# Altium project Integrated board-STM32.PrjPcb
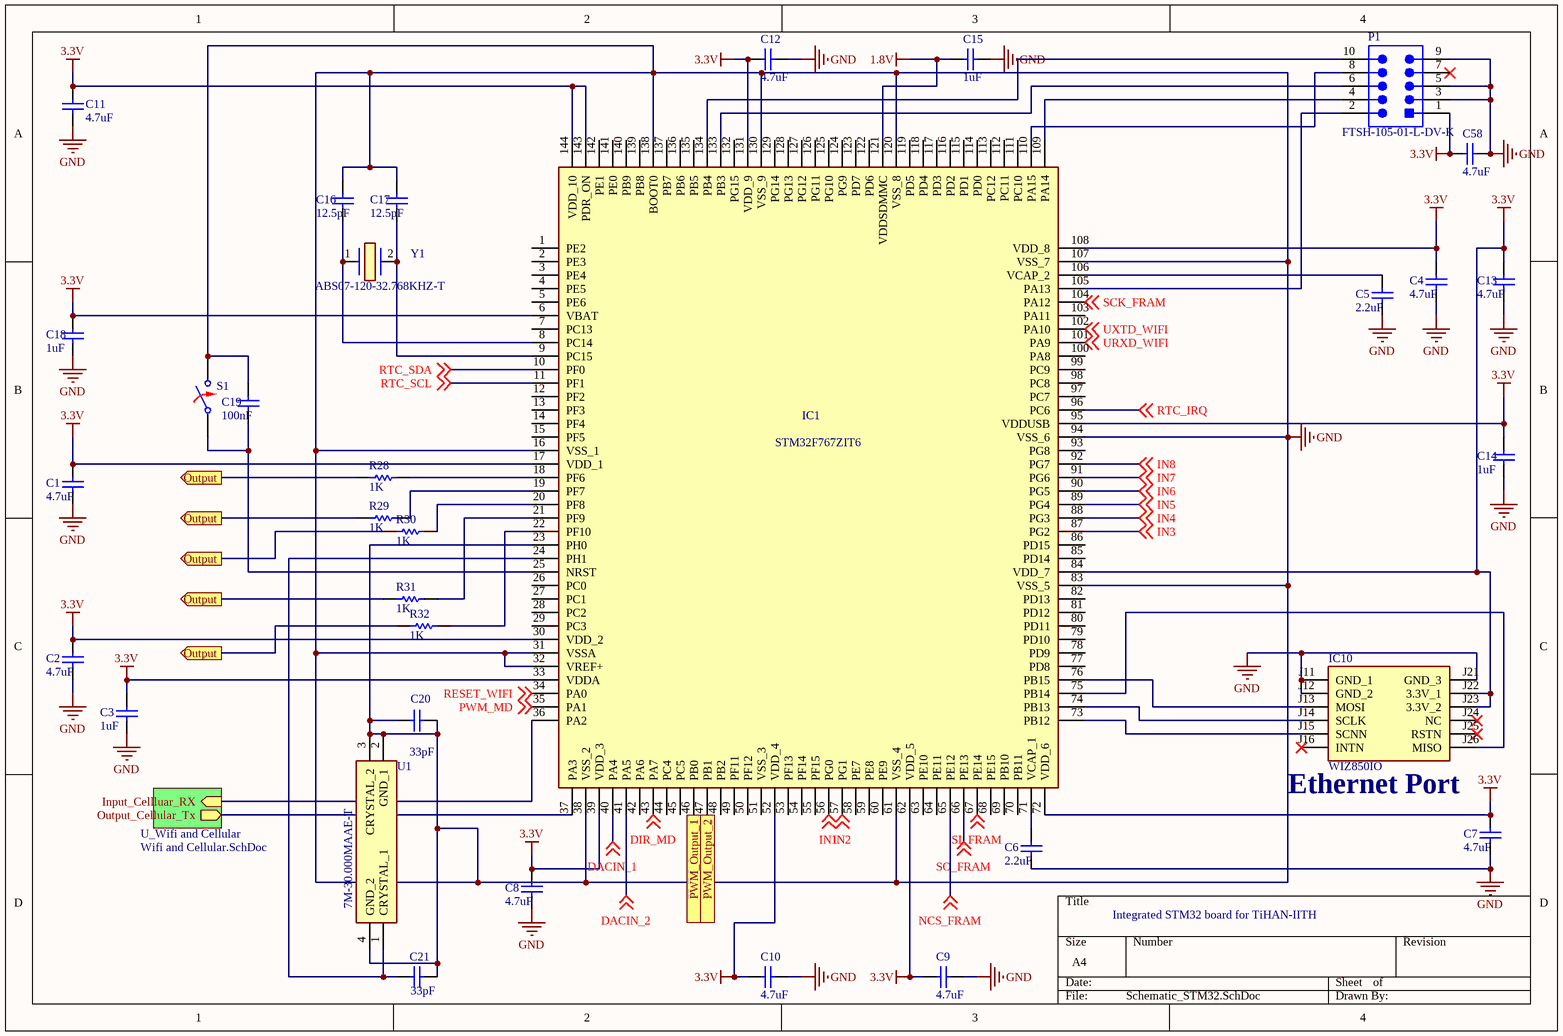
[diagram p0: Schematic_STM32.SchDoc]
7 sheets, 204 parts. Net scope: hierarchical (ports join the sheet entries above them; power ports are global).
Sheets:
  Schematic_STM32.SchDoc
  supply.SchDoc
  Relay_circuit.SchDoc
  Relay circuit_12V.SchDoc
  Wifi, Cellular, MD and FRAM.SchDoc
  Signal conditioning.SchDoc
  PWM_Generator.SchDoc

## Sheet Schematic_STM32.SchDoc
size A4; SheetNumber: 1; SheetTotal: 8

### Parts
(Parts that share a designator on the sheet are numbered #1, #2 ... from top to bottom, then left to right.)
C1  value 4.7uF  [C1206]  (hidden comment: Cap)
C2  value 4.7uF  [C1206]  (hidden comment: Cap)
C3  value 1uF  [C1206]  (hidden comment: Cap)
C4  value 4.7uF  [C1206]  (hidden comment: Cap)
C5  value 2.2uF  [C1206]  (hidden comment: Cap)
C6  value 2.2uF  [C1206]  (hidden comment: Cap)
C7  value 4.7uF  [C1206]  (hidden comment: Cap)
C8  value 4.7uF  [C1206]  (hidden comment: Cap)
C9  value 4.7uF  [C1206]  (hidden comment: Cap)
C10  value 4.7uF  [C1206]  (hidden comment: Cap)
C11  value 4.7uF  [C1206]  (hidden comment: Cap)
C12  value 4.7uF  [C1206]  (hidden comment: Cap)
C13  value 4.7uF  [C1206]  (hidden comment: Cap)
C14  value 1uF  [C1206]  (hidden comment: Cap)
C15  value 1uF  [C1206]  (hidden comment: Cap)
C16  value 12.5pF  [C1206]  (hidden comment: Cap)
C17  value 12.5pF  [C1206]  (hidden comment: Cap)
C18  value 1uF  [C1206]  (hidden comment: Cap)
C19  value 100nF  [C1206]  (hidden comment: Cap)
C20  value 33pF  [RAD-0.3]  (hidden comment: Cap)
C21  value 33pF  [RAD-0.3]  (hidden comment: Cap)
C58  value 4.7uF  [C1206]  (hidden comment: Cap)
IC1  STM32F767ZIT6  [QFP50P2200X2200X160-144N]
IC10  WIZ850IO  [WIZ850IO]
P1#1  FTSH-105-01-L-DV-K  [SMTC-FTSH-105-01-L-DV-K_V]
R28  value 1K  (hidden comment: Resistor)
R29  value 1K  (hidden comment: Resistor)
R30  value 1K  (hidden comment: Resistor)
R31  value 1K  (hidden comment: Resistor)
R32  value 1K  (hidden comment: Resistor)
S1  Switch Normally Opened  (value not drawn)
U1  7M-30.000MAAE-T  [7M]
Y1  ABS07-120-32.768KHZ-T  [ABS07]

### Sub-sheets
U_Wifi and Cellular = Wifi and Cellular.SchDoc (file not in this document): Input_Cellluar_RX (in), Output_Cellular_Tx (out)

### Ports
Output (out), PWM_Output_1 (out), PWM_Output_2 (out)

### Nets
1.8V: C15.1 IC1.121(VDDSDMMC)
3.3V: C1.1 C2.1 C3.1 C4.1 C7.1 C8.1 C9.1 C10.1 C11.1 C12.1 C13.1 C14.1 C18.1 C58.1 IC1.6(VBAT) IC1.17(VDD_1) IC1.30(VDD_2) IC1.33(VDDA) IC1.34(PA0) IC1.39(VDD_3) IC1.52(VDD_4) IC1.62(VDD_5) IC1.72(VDD_6) IC1.84(VDD_7) IC1.95(VDDUSB) IC1.108(VDD_8) IC1.131(VDD_9) IC1.143(PDR_ON) IC1.144(VDD_10) IC10.J22(3.3V_1) IC10.J23(3.3V_2) P1#1.1 ; off-sheet RESET_WIFI  [also labelled RESET_WIFI]
GND: C1.2 C2.2 C3.2 C4.2 C5.2 C6.2 C7.2 C8.2 C9.2 C10.2 C11.2 C12.2 C13.2 C14.2 C15.2 C16.1 C17.1 C18.2 C19.1 C20.1 C20.2 C21.2 C58.2 IC1.16(VSS_1) IC1.23(PH0) IC1.31(VSSA) IC1.32(VREF+) IC1.38(VSS_2) IC1.61(VSS_4) IC1.83(VSS_5) IC1.94(VSS_6) IC1.107(VSS_7) IC1.120(VSS_8) IC1.130(VSS_9) IC1.138(BOOT0) IC10.J11(GND_1) IC10.J12(GND_2) IC10.J21(GND_3) P1#1.3 P1#1.5 P1#1.9 S1.2 U1.2(GND_1) U1.3(CRYSTAL_2) U1.4(GND_2)
DACIN_1: IC1.40(PA4) ; off-sheet DACIN_1
DACIN_2: IC1.41(PA5) ; off-sheet DACIN_2
DIR_MD: IC1.43(PA7) ; off-sheet DIR_MD
IN1: IC1.56(PG0) ; off-sheet IN1
IN2: IC1.57(PG1) ; off-sheet IN2
IN3: IC1.87(PG2) ; off-sheet IN3
IN4: IC1.88(PG3) ; off-sheet IN4
IN5: IC1.89(PG4) ; off-sheet IN5
IN6: IC1.90(PG5) ; off-sheet IN6
IN7: IC1.91(PG6) ; off-sheet IN7
IN8: IC1.92(PG7) ; off-sheet IN8
NCS_FRAM: IC1.65(PE12) ; off-sheet NCS_FRAM
PWM_MD: IC1.35(PA1) ; off-sheet PWM_MD
RTC_IRQ: IC1.96(PC6) ; off-sheet RTC_IRQ
RTC_SCL: IC1.11(PF1) ; off-sheet RTC_SCL
RTC_SDA: IC1.10(PF0) ; off-sheet RTC_SDA
SCK_FRAM: IC1.104(PA12) ; off-sheet SCK_FRAM
SI_FRAM: IC1.67(PE14) ; off-sheet SI_FRAM
SO_FRAM: IC1.66(PE13) ; off-sheet SO_FRAM
URXD_WIFI: IC1.101(PA9) ; off-sheet URXD_WIFI
UXTD_WIFI: IC1.102(PA10) ; off-sheet UXTD_WIFI
NetC5_1: C5.1 IC1.106(VCAP_2)
NetC6_1: C6.1 IC1.71(VCAP_1)
NetC16_2: C16.2 IC1.8(PC14) Y1.1
NetC17_2: C17.2 IC1.9(PC15) Y1.2
NetC19_2: C19.2 IC1.25(NRST) S1.1
NetC21_1: C21.1 IC1.24(PH1) U1.1(CRYSTAL_1)
NetIC1_18: IC1.18(PF6) R28.2
NetIC1_19: IC1.19(PF7) R29.2
NetIC1_20: IC1.20(PF8) R30.2
NetIC1_21: IC1.21(PF9) R31.2
NetIC1_22: IC1.22(PF10) R32.2
NetIC1_36: IC1.36(PA2) ; sheet U_Wifi and Cellular/Input_Cellluar_RX
NetIC1_37: IC1.37(PA3) ; sheet U_Wifi and Cellular/Output_Cellular_Tx
NetIC1_46: IC1.46(PB0) ; port PWM_Output_1
NetIC1_47: IC1.47(PB1) ; port PWM_Output_2
NetIC1_73: IC1.73(PB12) IC10.J15(SCNN)
NetIC1_74: IC1.74(PB13) IC10.J14(SCLK)
NetIC1_75: IC1.75(PB14) IC10.J26(MISO)
NetIC1_76: IC1.76(PB15) IC10.J13(MOSI)
NetIC1_105: IC1.105(PA13) P1#1.2
NetIC1_109: IC1.109(PA14) P1#1.4
NetIC1_110: IC1.110(PA15) P1#1.8
NetIC1_133: IC1.133(PB3) P1#1.6
NetIC1_134: IC1.134(PB4) P1#1.10
NetR28_1: R28.1 R29.1 R30.1 R31.1 R32.1 ; port Output

Not connected (* = marked no-connect by the designer): IC1 1(PE2) 2(PE3) 3(PE4) 4(PE5) 5(PE6) 7(PC13) 12(PF2) 13(PF3) 14(PF4) 15(PF5) 26(PC0) 27(PC1) 28(PC2) 29(PC3) 42(PA6) 44(PC4) 45(PC5) 48(PB2) 49(PF11) 50(PF12) 51(VSS_3) 53(PF13) 54(PF14) 55(PF15) 58(PE7) 59(PE8) 60(PE9) 63(PE10) 64(PE11) 68(PE15) 69(PB10) 70(PB11) 77(PD8) 78(PD9) 79(PD10) 80(PD11) 81(PD12) 82(PD13) 85(PD14) 86(PD15) 93(PG8) 97(PC7) 98(PC8) 99(PC9) 100(PA8) 103(PA11) 111(PC10) 112(PC11) 113(PC12) 114(PD0) 115(PD1) 116(PD2) 117(PD3) 118(PD4) 119(PD5) 122(PD6) 123(PD7) 124(PG9) 125(PG10) 126(PG11) 127(PG12) 128(PG13) 129(PG14) 132(PG15) 135(PB5) 136(PB6) 137(PB7) 139(PB8) 140(PB9) 141(PE0) 142(PE1); IC10 J16(INTN)* J24(NC)* J25(RSTN)*; P1#1 7*

### Notes on the sheet
- Ethernet Port
- Integrated STM32 board for TiHAN-IITH

### Library data of the parts
C1-C19 C58 = Cap Semi: Capacitor (Semiconductor SIM Model); Published: 8-Jun-2000; LatestRevisionDate: 29-May-2009; LatestRevisionNote: IPC-7351 Footprint Added.; PackageReference: C1206; Publisher: Altium Limited; PackageDescription: Chip Capacitor
C20 C21 = Cap: Capacitor; Published: 8-Jun-2000; LatestRevisionDate: 17-Jul-2002; LatestRevisionNote: Re-released for DXP Platform.; PackageReference: RAD-0.3; Publisher: Altium Limited; PackageDescription: Radial Cap, Thru-Hole; 2 Leads; 0.3 in Pin Spacing
IC1 = STM32F767ZIT6: Integrated Circuit; Manufacturer_Name: STMicroelectronics; Datasheet Link: http://www.farnell.com/datasheets/2034586.pdf; Height: 1.6mm; Manufacturer_Part_Number: STM32F767ZIT6; Mouser Part Number: 511-STM32F767ZIT6; Mouser Price/Stock: https://www.mouser.co.uk/ProductDetail/STMicroelectronics/STM32F767ZIT6?qs=dTJS0cRn7ojkBH6ijW6kKw%3D%3D; Arrow Part Number: STM32F767ZIT6; Arrow Price/Stock: https://www.arrow.com/en/products/stm32f767zit6/stmicroelectronics?region=nac
IC10 = WIZ850IO: Integrated Circuit; Manufacturer_Name: Wiznet Technology; Datasheet Link: https://docs.wiznet.io/Product/ioModule/wiz850io; Height: 18mm; Manufacturer_Part_Number: WIZ850IO; Mouser Part Number: 950-WIZ850IO; Arrow Part Number: WIZ850IO; Arrow Price/Stock: https://www.arrow.com/en/products/wiz850io/wiznet?region=nac
P1#1 = CMP-2000-05353-1: Male Header, Pitch 1.27 mm, 2 x 5 Position, Height 6.25 mm; Manufacturer: Samtec; Pitch: 0.050"(1.27mm); Other Names: Q3937619; Number of Positions: 10; Mating Products: SFMC-105-L2-S-D-TR-ND / -CONN.05"SURFACE10POSSMT / FLE-105-01-G-DV-TR-ND / -CONNSKT1.27MM10POSDUALSMD / FLE-105-01-G-DV-A-P-ND / -CONNSKT1.27MM10POSDUALSMD / FLE-105-01-G-DV-A-ND / -CONNSKT1.27MM10POSDUALSMD / CLP-105-02-G-D-P-TR-ND / -CONNRCPT10POSDUAL.05"SMD / SAM1155-05-ND / -CONNRCPT10POSDUAL.05"SMD / SAM1154-05-ND / -CONNRCPT10POSDUAL.05"SMD / SAM1153-05-ND / -CONNRCPT10POSDUAL.05"SMD / SAM1226-05-ND / -CONNRCPT.05"10POSDUALSMD; Number of Positions Loaded: All; Connector Type: Header,Unshrouded; Product Training Modules: Board-to-BoardConnectors; Datasheet Version: Rev. ET, 10/1995; Number of Rows: 2; Standard Package: 1; Package Description: Male Header, Pitch 1.27 mm, 2 x 5 Position, Height 5.97 mm, Tail Length 4.32 mm; Contact Finish Thickness: 10µin(0.25µm); Series: FTSH; Termination: Solder; Contact Type: MalePin; Color: Black; Package Reference: FTSH-105-01-L-DV-K; Family: RectangularConnectors-Headers,MalePins; Package URL: http://suddendocs.samtec.com/prints/ftsh-1xx-xx-xxx-dv-xxx-footprint.pdf; Packaging: Tube; Mounting Type: SurfaceMount; Category: Connectors,Interconnects; Datasheet URL: http://suddendocs.samtec.com/prints/ftsh-1xx-xx-xxx-dv-xxx-mkt.pdf; Row Spacing: 0.050"(1.27mm); Manufacturer URL: http://www.samtec.com/; Contact Mating Length: 0.120"(3.05mm); Contact Finish: Gold
R28-R32 = Resistor: TC1: 0; SimulationGenericComponent: True; TC2: 0
S1 = SW NO: closed: 0; Rclosed: 1m; Ropen: 1Meg; SimulationGenericComponent: True
U1 = 7M-30.000MAAE-T: Crystal or Oscillator; Manufacturer_Name: TXC; Datasheet Link: http://www.txccorp.com/download/products/quartz_crystals/2015TXC_7M_17.pdf; Manufacturer_Part_Number: 7M-30.000MAAE-T; Mouser Part Number: 717-7M-30.000MAAE-T; Mouser Price/Stock: https://www.mouser.com/Search/Refine.aspx?Keyword=717-7M-30.000MAAE-T
Y1 = ABS07-120-32.768KHZ-T: Crystal or Oscillator; Manufacturer_Name: ABRACON; Datasheet Link: https://abracon.com/Resonators/ABS07.pdf; Height: 0.9mm; Manufacturer_Part_Number: ABS07-120-32.768KHZ-T; Mouser Part Number: 815-ABS0712032.768KT; Mouser Price/Stock: https://www.mouser.co.uk/ProductDetail/ABRACON/ABS07-120-32.768KHZ-T?qs=z9S2%252BbP5pWhyNaQ4AovDCg%3D%3D; Arrow Part Number: ABS07-120-32.768KHZ-T; Arrow Price/Stock: https://www.arrow.com/en/products/abs07-120-32.768khz-t/abracon?region=nac

## Sheet supply.SchDoc
size A4; SheetNumber: 2; SheetTotal: 9
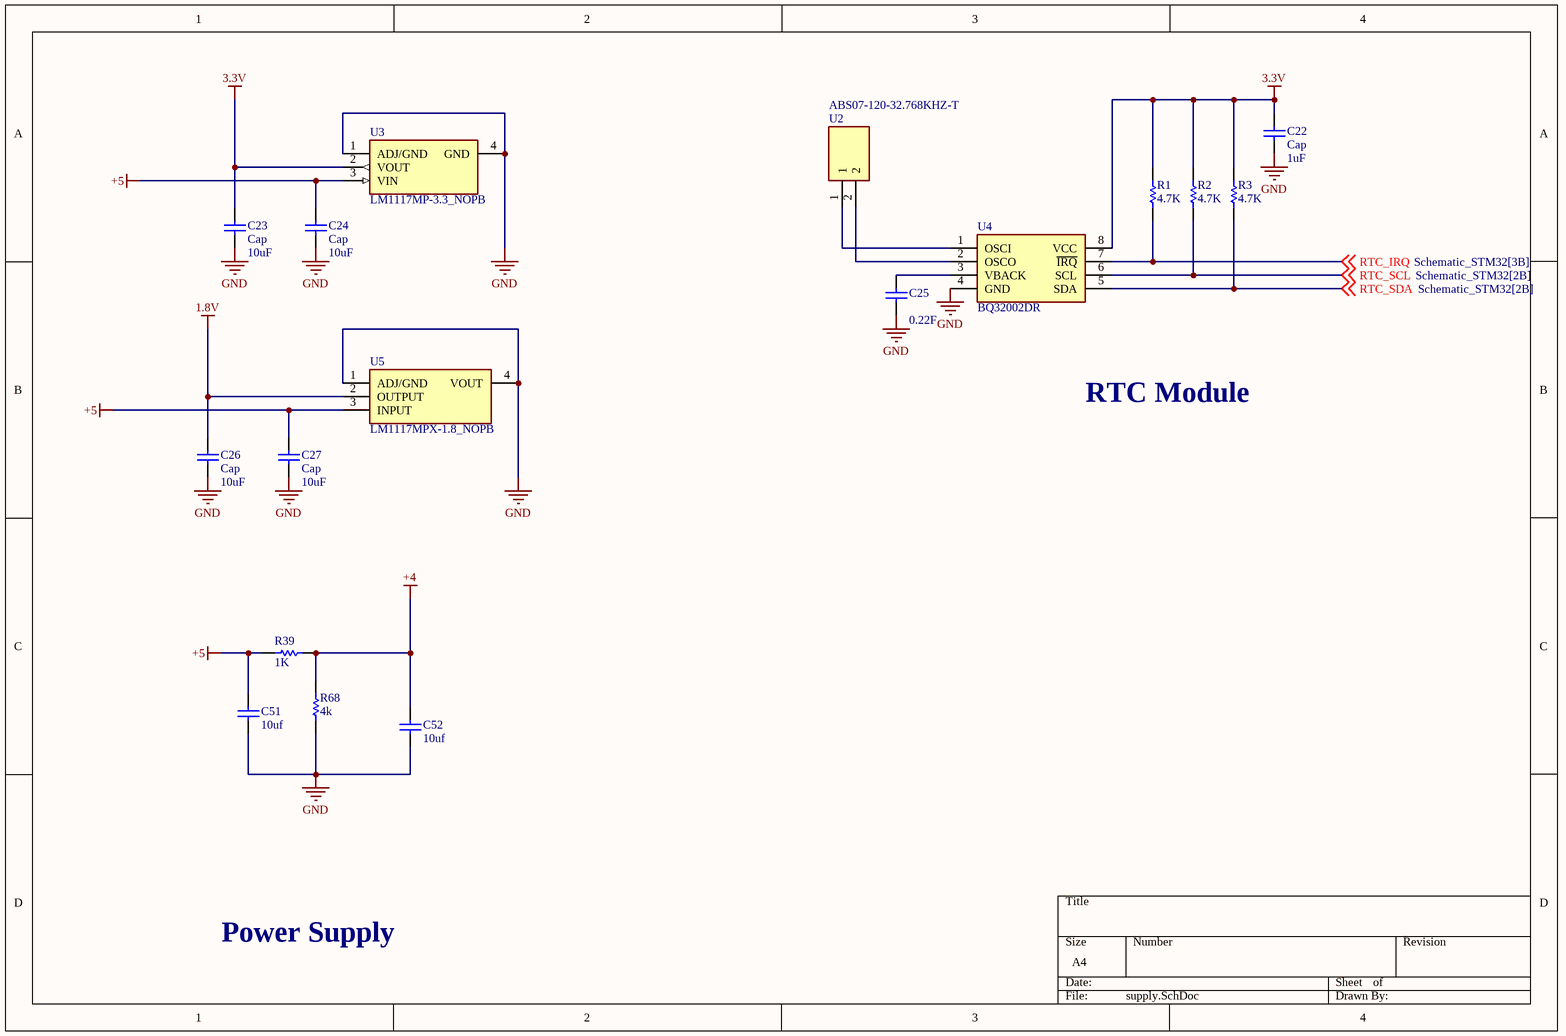
[diagram p1: supply.SchDoc]

### Parts
C22  Cap  value 1uF  [RAD-0.3]
C23  Cap  value 10uF  [RAD-0.3]
C24  Cap  value 10uF  [RAD-0.3]
C25  value 0.22F  [RAD-0.3]  (hidden comment: Cap)
C26  Cap  value 10uF  [RAD-0.3]
C27  Cap  value 10uF  [RAD-0.3]
C51  value 10uf  (hidden comment: Capacitor)
C52  value 10uf  (hidden comment: Capacitor)
R1  value 4.7K  [AXIAL-0.3]  (hidden comment: Res1)
R2  value 4.7K  [AXIAL-0.3]  (hidden comment: Res1)
R3  value 4.7K  [AXIAL-0.3]  (hidden comment: Res1)
R39  value 1K  (hidden comment: Resistor)
R68  value 4k  (hidden comment: Resistor)
U2  ABS07-120-32.768KHZ-T  [ABS-07]
U3  LM1117MP-3.3_NOPB  [SOT230P700X180-4N]
U4  BQ32002DR  [SOIC127P600X175-8N]
U5  LM1117MPX-1.8_NOPB  [SOT230P700X180-4N]

### Nets
1.8V: C26.2 U5.2(OUTPUT)
3.3V: C22.2 C23.2 R1.1 R2.1 R3.1 U3.2(VOUT) U4.8(VCC)
+4: C52.2 R39.2 R68.2
+5: C24.2 C27.2 C51.2 R39.1 U3.3(VIN) U5.3(INPUT)
GND: C22.1 C23.1 C24.1 C25.1 C26.1 C27.1 C51.1 C52.1 R68.1 U3.1(ADJ/GND) U3.4(GND) U4.4(GND) U5.1(ADJ/GND) U5.4(VOUT)
RTC_IRQ: R1.2 U4.7(~{IRQ}) ; off-sheet RTC_IRQ
RTC_SCL: R2.2 U4.6(SCL) ; off-sheet RTC_SCL
RTC_SDA: R3.2 U4.5(SDA) ; off-sheet RTC_SDA
NetC25_2: C25.2 U4.3(VBACK)
NetU2_1: U2.1 U4.1(OSCI)
NetU2_2: U2.2 U4.2(OSCO)

### Notes on the sheet
- RTC Module
- Power Supply

### Library data of the parts
C22-C27 = Cap: Capacitor; Published: 8-Jun-2000; LatestRevisionDate: 17-Jul-2002; LatestRevisionNote: Re-released for DXP Platform.; PackageReference: RAD-0.3; Publisher: Altium Limited; PackageDescription: Radial Cap, Thru-Hole; 2 Leads; 0.3 in Pin Spacing
C51 C52 = Capacitor: SimulationGenericComponent: True
R1-R3 = Res1: Resistor; Published: 8-Jun-2000; LatestRevisionDate: 17-Jul-2002; LatestRevisionNote: Re-released for DXP Platform.; PackageReference: AXIAL-0.3; Publisher: Altium Limited; PackageDescription: Axial Device, Thru-Hole; 2 Leads; 0.3 in Pin Spacing
R39 R68 = Resistor: TC1: 0; SimulationGenericComponent: True; TC2: 0
U2 = ABS07-120-32.768KHZ-T: as Y1 on sheet Schematic_STM32; Datasheet Link: http://www.abracon.com/Resonators/ABS07-120-32.768kHz-T.pdf; Manufacturer_Part_Number: ABS07-120-32.768KHZ-T; Mouser Part Number: 815-ABS0712032.768KT; Mouser Price/Stock: https://www.mouser.co.uk/ProductDetail/ABRACON/ABS07-120-32768KHZ-T?qs=z9S2%252BbP5pWhyNaQ4AovDCg%3D%3D; RS Part Number: 1712688P; RS Price/Stock: http://uk.rs-online.com/web/p/products/1712688P
U3 = LM1117MP-3.3_NOPB: Integrated Circuit; Manufacturer_Name: Texas Instruments; Manufacturer_Part_Number: LM1117MP-3.3/NOPB; Datasheet Link: http://docs-emea.rs-online.com/webdocs/0780/0900766b807800d2.pdf; Height: 1.8mm; Mouser Part Number: 926-LM1117MP-3.3NOPB; Mouser Price/Stock: https://www.mouser.com/Search/Refine.aspx?Keyword=926-LM1117MP-3.3NOPB; RS Part Number: 5339577P; RS Price/Stock: http://uk.rs-online.com/web/p/products/5339577P
U4 = BQ32002DR: Integrated Circuit; Manufacturer_Name: Texas Instruments; Datasheet Link: http://www.ti.com/lit/gpn/bq32002; Height: 1.75mm; Manufacturer_Part_Number: BQ32002DR; Mouser Part Number: 595-BQ32002DR; Mouser Price/Stock: https://www.mouser.com/Search/Refine.aspx?Keyword=595-BQ32002DR
U5 = LM1117MPX-1.8_NOPB: Integrated Circuit; Manufacturer_Name: Texas Instruments; Manufacturer_Part_Number: LM1117MPX-1.8/NOPB; Datasheet Link: http://www.ti.com/lit/gpn/lm1117; Height: 1.8mm; Mouser Part Number: 926-LM1117MPX1.8NOPB; Mouser Price/Stock: https://www.mouser.com/Search/Refine.aspx?Keyword=926-LM1117MPX1.8NOPB

## Sheet Relay_circuit.SchDoc
size A4; SheetNumber: 3; SheetTotal: 6
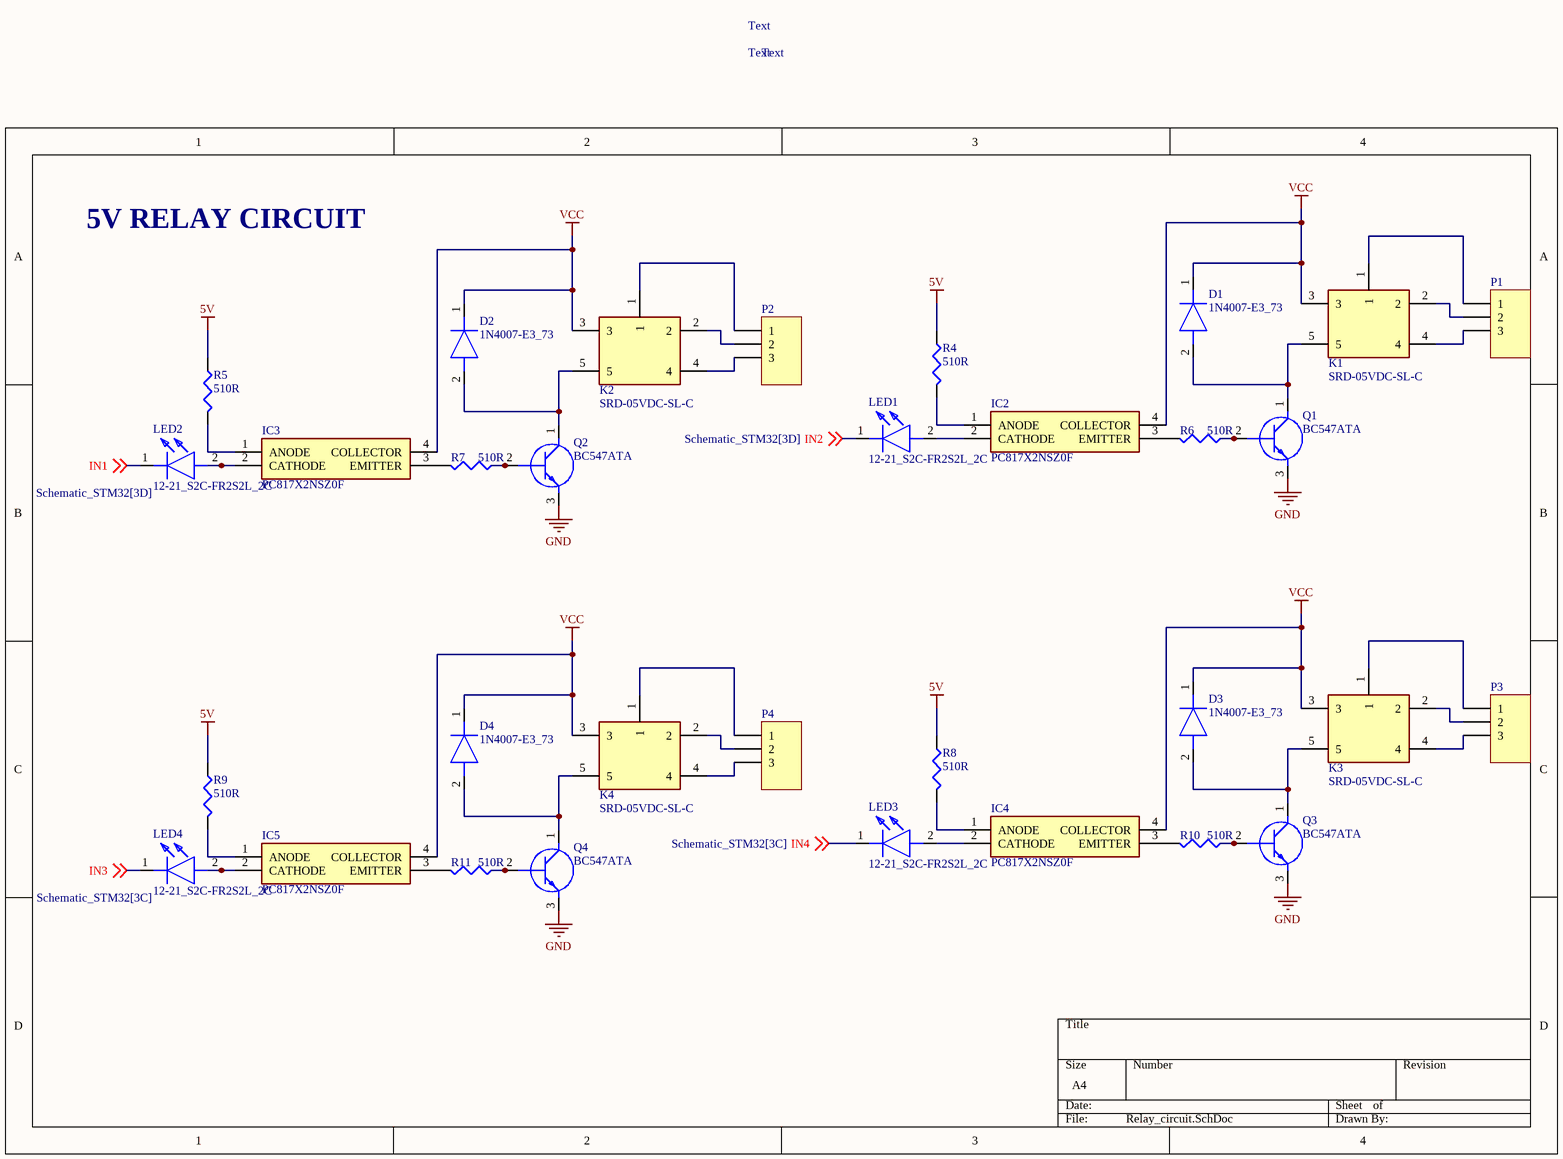
[diagram p2: Relay_circuit.SchDoc]

### Parts
(Parts that share a designator on the sheet are numbered #1, #2 ... from top to bottom, then left to right.)
D1  1N4007-E3_73  [DIOAD1405W86L465D235]
D2  1N4007-E3_73  [DIOAD1405W86L465D235]
D3  1N4007-E3_73  [DIOAD1405W86L465D235]
D4  1N4007-E3_73  [DIOAD1405W86L465D235]
IC2  PC817X2NSZ0F  [DIP762W60P254L458H400Q4N]
IC3  PC817X2NSZ0F  [DIP762W60P254L458H400Q4N]
IC4  PC817X2NSZ0F  [DIP762W60P254L458H400Q4N]
IC5  PC817X2NSZ0F  [DIP762W60P254L458H400Q4N]
K1  SRD-05VDC-SL-C  [SRD]
K2  SRD-05VDC-SL-C  [SRD]
K3  SRD-05VDC-SL-C  [SRD]
K4  SRD-05VDC-SL-C  [SRD]
LED1  12-21_S2C-FR2S2L_2C  [1221S2CFR2S2L2C]
LED2  12-21_S2C-FR2S2L_2C  [1221S2CFR2S2L2C]
LED3  12-21_S2C-FR2S2L_2C  [1221S2CFR2S2L2C]
LED4  12-21_S2C-FR2S2L_2C  [1221S2CFR2S2L2C]
P1#2  Header 3  [CON4PIN5MM]  (value not drawn)
P2  Header 3  [CON4PIN5MM]  (value not drawn)
P3  Header 3  [CON4PIN5MM]  (value not drawn)
P4  Header 3  [CON4PIN5MM]  (value not drawn)
Q1  BC547ATA  [TO-92_(TO-226)]
Q2  BC547ATA  [TO-92_(TO-226)]
Q3  BC547ATA  [TO-92_(TO-226)]
Q4  BC547ATA  [TO-92_(TO-226)]
R4  value 510R  [J1-0603]  (hidden comment: Res3)
R5  value 510R  [J1-0603]  (hidden comment: Res3)
R6  value 510R  [J1-0603]  (hidden comment: Res3)
R7  value 510R  [J1-0603]  (hidden comment: Res3)
R8  value 510R  [J1-0603]  (hidden comment: Res3)
R9  value 510R  [J1-0603]  (hidden comment: Res3)
R10  value 510R  [J1-0603]  (hidden comment: Res3)
R11  value 510R  [J1-0603]  (hidden comment: Res3)

### Nets
5V: R4.1 R5.1 R8.1 R9.1
GND: Q1.3(E) Q2.3(E) Q3.3(E) Q4.3(E)
VCC: D1.1(K) D2.1(K) D3.1(K) D4.1(K) IC2.4(COLLECTOR) IC3.4(COLLECTOR) IC4.4(COLLECTOR) IC5.4(COLLECTOR) K1.3 K2.3 K3.3 K4.3
IN1: LED2.1(K) ; off-sheet IN1
IN2: LED1.1(K) ; off-sheet IN2
IN3: LED4.1(K) ; off-sheet IN3
IN4: LED3.1(K) ; off-sheet IN4
NetD1_2: D1.2(A) K1.5 Q1.1(C)
NetD2_2: D2.2(A) K2.5 Q2.1(C)
NetD3_2: D3.2(A) K3.5 Q3.1(C)
NetD4_2: D4.2(A) K4.5 Q4.1(C)
NetIC2_1: IC2.1(ANODE) R4.2
NetIC2_2: IC2.2(CATHODE) LED1.2(A)
NetIC2_3: IC2.3(EMITTER) R6.2
NetIC3_1: IC3.1(ANODE) R5.2
NetIC3_2: IC3.2(CATHODE) LED2.2(A)
NetIC3_3: IC3.3(EMITTER) R7.2
NetIC4_1: IC4.1(ANODE) R8.2
NetIC4_2: IC4.2(CATHODE) LED3.2(A)
NetIC4_3: IC4.3(EMITTER) R10.2
NetIC5_1: IC5.1(ANODE) R9.2
NetIC5_2: IC5.2(CATHODE) LED4.2(A)
NetIC5_3: IC5.3(EMITTER) R11.2
NetK1_1: K1.1 P1#2.1
NetK1_2: K1.2 P1#2.2
NetK1_4: K1.4 P1#2.3
NetK2_1: K2.1 P2.1
NetK2_2: K2.2 P2.2
NetK2_4: K2.4 P2.3
NetK3_1: K3.1 P3.1
NetK3_2: K3.2 P3.2
NetK3_4: K3.4 P3.3
NetK4_1: K4.1 P4.1
NetK4_2: K4.2 P4.2
NetK4_4: K4.4 P4.3
NetQ1_2: Q1.2(B) R6.1
NetQ2_2: Q2.2(B) R7.1
NetQ3_2: Q3.2(B) R10.1
NetQ4_2: Q4.2(B) R11.1

Not connected (* = marked no-connect by the designer): P1#2 4; P2 4; P3 4; P4 4

### Notes on the sheet
- Text
- 5V RELAY CIRCUIT

### Library data of the parts
D1-D4 = 1N4007-E3_73: Diode; Manufacturer_Name: Vishay; Manufacturer_Part_Number: 1N4007-E3/73; Datasheet Link: https://mouser.componentsearchengine.com/Datasheets/2/1N4007-E3_73.pdf; Mouser Part Number: 625-1N4007-E3/73; Mouser Price/Stock: https://www.mouser.co.uk/ProductDetail/Vishay-General-Semiconductor/1N4007-E3-73?qs=N4vtoAxH%2FSqT3Ng3e4K0Gw%3D%3D; Arrow Part Number: 1N4007-E3/73; Arrow Price/Stock: https://www.arrow.com/en/products/1n4007-e373/vishay?region=europe
IC2-IC5 = PC817X2NSZ0F: Integrated Circuit; Manufacturer_Name: Sharp Microelectronics; Datasheet Link: https://datasheet.datasheetarchive.com/originals/distributors/Datasheets_SAMA/458e45842a103a05998fcebbd6f7366e.pdf; Height: 4mm; Manufacturer_Part_Number: PC817X2NSZ0F; Mouser Part Number: N/A; Mouser Price/Stock: https://www.mouser.co.uk/ProductDetail/Sharp-Microelectronics/PC817X2NSZ0F?qs=6kT3pPPHxnU7uYWM8Yy85A%3D%3D
K1-K4 = SRD-05VDC-SL-C: Relay or Contactor; Manufacturer_Name: Songle Relay; Datasheet Link: http://files.microjpm.webnode.com/200001010-dda41de9e1/Songle%20Relay%20Datasheet.pdf; Manufacturer_Part_Number: SRD-05VDC-SL-C
LED1-LED4 = 12-21_S2C-FR2S2L_2C: LED; Manufacturer_Name: Everlight; Manufacturer_Part_Number: 12-21/S2C-FR2S2L/2C; Datasheet Link: https://datasheet.lcsc.com/szlcsc/1901141904_Everlight-Elec-12-21-S2C-FR2S2L-2C_C183856.pdf; Height: 2.2mm
P1#2 P2-P4 = Header 4: Header, 4-Pin; LatestRevisionDate: 17-Jul-2002; LatestRevisionNote: Re-released for DXP Platform.; Publisher: Altium Limited
Q1-Q4 = BC547ATA: Transistor BJT NPN; Manufacturer_Name: onsemi; Datasheet Link: https://www.onsemi.com/pub/Collateral/BC550-D.pdf; Manufacturer_Part_Number: BC547ATA; Mouser Part Number: 512-BC547ATA; Mouser Price/Stock: https://www.mouser.co.uk/ProductDetail/onsemi-Fairchild/BC547ATA?qs=ljbEvF4DwOMRdLfuzO8N4w%3D%3D; Arrow Part Number: BC547ATA; Arrow Price/Stock: https://www.arrow.com/en/products/bc547ata/on-semiconductor?region=europe
R4-R11 = Res3: Resistor; Published: 8-Jun-2000; LatestRevisionDate: 29-May-2009; LatestRevisionNote: IPC-7351 Footprint Added.; PackageReference: J1-0603; Publisher: Altium Limited; PackageDescription: Chip Resistor

## Sheet Relay circuit_12V.SchDoc
size A4; SheetNumber: 4; SheetTotal: 6
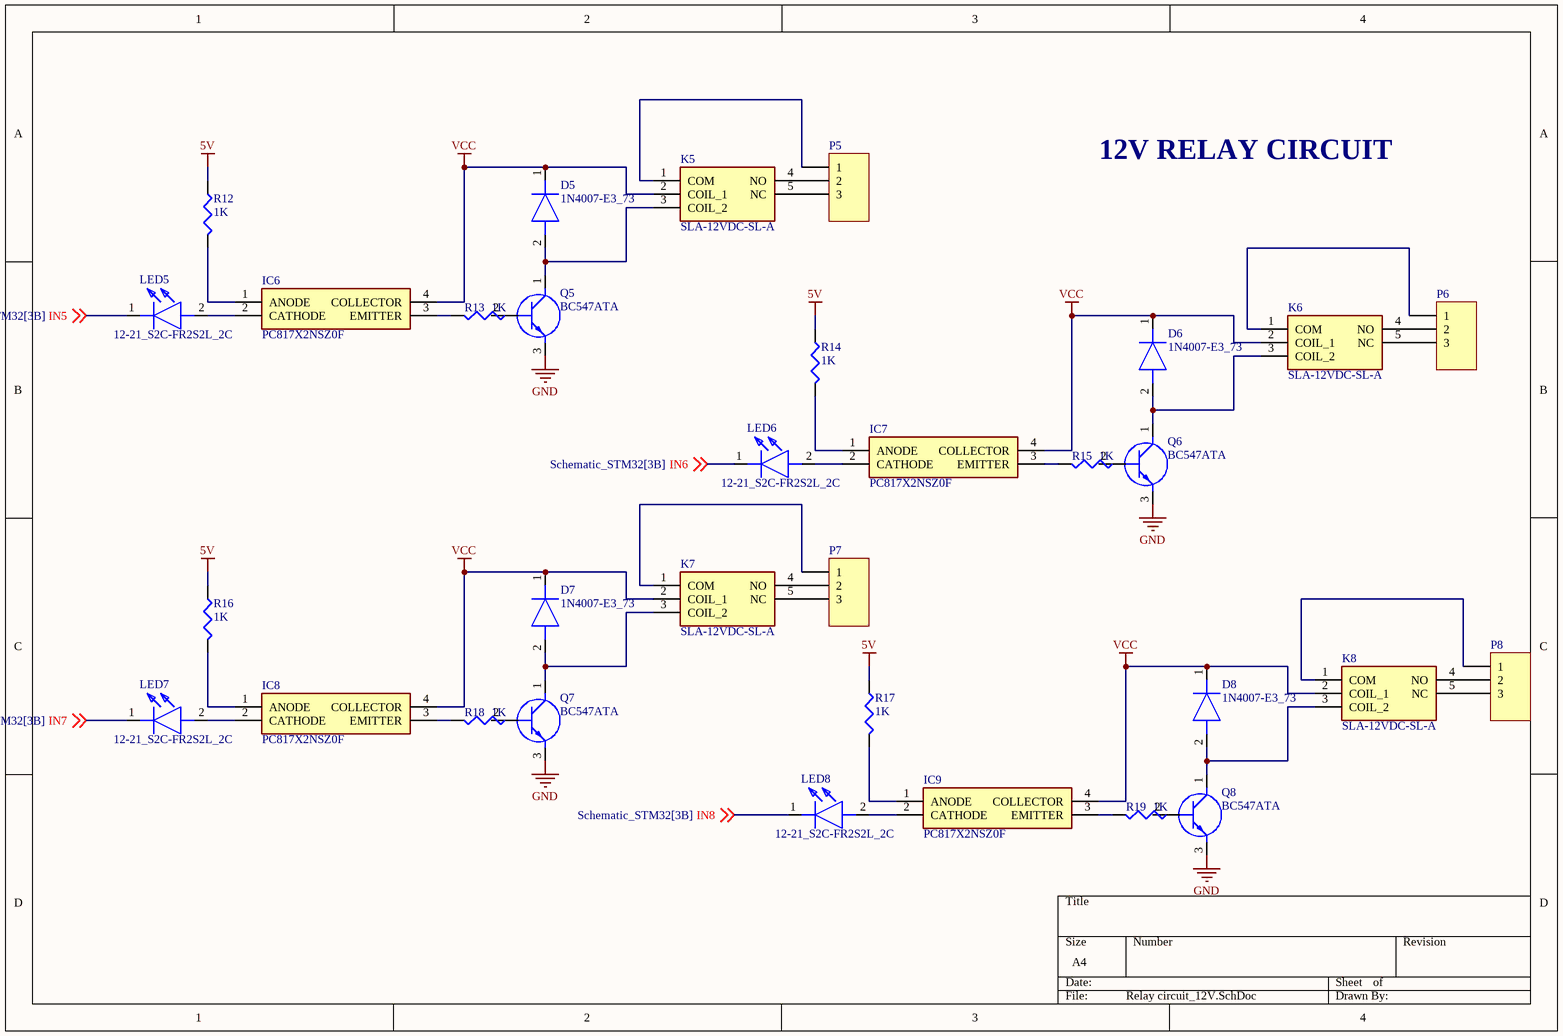
[diagram p3: Relay circuit_12V.SchDoc]

### Parts
D5  1N4007-E3_73  [DIOAD1405W86L465D235]
D6  1N4007-E3_73  [DIOAD1405W86L465D235]
D7  1N4007-E3_73  [DIOAD1405W86L465D235]
D8  1N4007-E3_73  [DIOAD1405W86L465D235]
IC6  PC817X2NSZ0F  [DIP762W60P254L458H400Q4N]
IC7  PC817X2NSZ0F  [DIP762W60P254L458H400Q4N]
IC8  PC817X2NSZ0F  [DIP762W60P254L458H400Q4N]
IC9  PC817X2NSZ0F  [DIP762W60P254L458H400Q4N]
K5  SLA-12VDC-SL-A  [SLA12VDCSLA]
K6  SLA-12VDC-SL-A  [SLA12VDCSLA]
K7  SLA-12VDC-SL-A  [SLA12VDCSLA]
K8  SLA-12VDC-SL-A  [SLA12VDCSLA]
LED5  12-21_S2C-FR2S2L_2C  [1221S2CFR2S2L2C]
LED6  12-21_S2C-FR2S2L_2C  [1221S2CFR2S2L2C]
LED7  12-21_S2C-FR2S2L_2C  [1221S2CFR2S2L2C]
LED8  12-21_S2C-FR2S2L_2C  [1221S2CFR2S2L2C]
P5  Header 3  [CON4PIN5MM]  (value not drawn)
P6  Header 3  [CON4PIN5MM]  (value not drawn)
P7  Header 3  [CON4PIN5MM]  (value not drawn)
P8  Header 3  [CON4PIN5MM]  (value not drawn)
Q5  BC547ATA  [TO-92_(TO-226)]
Q6  BC547ATA  [TO-92_(TO-226)]
Q7  BC547ATA  [TO-92_(TO-226)]
Q8  BC547ATA  [TO-92_(TO-226)]
R12  value 1K  [J1-0603]  (hidden comment: Res3)
R13  value 1K  [J1-0603]  (hidden comment: Res3)
R14  value 1K  [J1-0603]  (hidden comment: Res3)
R15  value 1K  [J1-0603]  (hidden comment: Res3)
R16  value 1K  [J1-0603]  (hidden comment: Res3)
R17  value 1K  [J1-0603]  (hidden comment: Res3)
R18  value 1K  [J1-0603]  (hidden comment: Res3)
R19  value 1K  [J1-0603]  (hidden comment: Res3)

### Nets
5V: R12.1 R14.1 R16.1 R17.1
GND: Q5.3(E) Q6.3(E) Q7.3(E) Q8.3(E)
VCC: D5.1(K) D6.1(K) D7.1(K) D8.1(K) IC6.4(COLLECTOR) IC7.4(COLLECTOR) IC8.4(COLLECTOR) IC9.4(COLLECTOR) K5.2(COIL_1) K6.2(COIL_1) K7.2(COIL_1) K8.2(COIL_1)
IN5: LED5.1(K) ; off-sheet IN5
IN6: LED6.1(K) ; off-sheet IN6
IN7: LED7.1(K) ; off-sheet IN7
IN8: LED8.1(K) ; off-sheet IN8
NetD5_2: D5.2(A) K5.3(COIL_2) Q5.1(C)
NetD6_2: D6.2(A) K6.3(COIL_2) Q6.1(C)
NetD7_2: D7.2(A) K7.3(COIL_2) Q7.1(C)
NetD8_2: D8.2(A) K8.3(COIL_2) Q8.1(C)
NetIC6_1: IC6.1(ANODE) R12.2
NetIC6_2: IC6.2(CATHODE) LED5.2(A)
NetIC6_3: IC6.3(EMITTER) R13.2
NetIC7_1: IC7.1(ANODE) R14.2
NetIC7_2: IC7.2(CATHODE) LED6.2(A)
NetIC7_3: IC7.3(EMITTER) R15.2
NetIC8_1: IC8.1(ANODE) R16.2
NetIC8_2: IC8.2(CATHODE) LED7.2(A)
NetIC8_3: IC8.3(EMITTER) R18.2
NetIC9_1: IC9.1(ANODE) R17.2
NetIC9_2: IC9.2(CATHODE) LED8.2(A)
NetIC9_3: IC9.3(EMITTER) R19.2
NetK5_1: K5.1(COM) P5.1
NetK5_4: K5.4(NO) P5.2
NetK5_5: K5.5(NC) P5.3
NetK6_1: K6.1(COM) P6.1
NetK6_4: K6.4(NO) P6.2
NetK6_5: K6.5(NC) P6.3
NetK7_1: K7.1(COM) P7.1
NetK7_4: K7.4(NO) P7.2
NetK7_5: K7.5(NC) P7.3
NetK8_1: K8.1(COM) P8.1
NetK8_4: K8.4(NO) P8.2
NetK8_5: K8.5(NC) P8.3

Not connected (* = marked no-connect by the designer): P5 4; P6 4; P7 4; P8 4; Q5 2(B); Q6 2(B); Q7 2(B); Q8 2(B); R13 1; R15 1; R18 1; R19 1

### Notes on the sheet
- 12V RELAY CIRCUIT

### Library data of the parts
D5-D8 = 1N4007-E3_73: as D1 on sheet Relay_circuit; Datasheet Link: https://mouser.componentsearchengine.com/Datasheets/2/1N4007-E3_73.pdf; Mouser Part Number: 625-1N4007-E3/73; Mouser Price/Stock: https://www.mouser.co.uk/ProductDetail/Vishay-General-Semiconductor/1N4007-E3-73?qs=N4vtoAxH%2FSqT3Ng3e4K0Gw%3D%3D; Arrow Part Number: 1N4007-E3/73; Arrow Price/Stock: https://www.arrow.com/en/products/1n4007-e373/vishay?region=europe
IC6-IC9 = PC817X2NSZ0F: as IC2 on sheet Relay_circuit; Datasheet Link: https://datasheet.datasheetarchive.com/originals/distributors/Datasheets_SAMA/458e45842a103a05998fcebbd6f7366e.pdf; Height: 4mm; Manufacturer_Part_Number: PC817X2NSZ0F; Mouser Part Number: N/A; Mouser Price/Stock: https://www.mouser.co.uk/ProductDetail/Sharp-Microelectronics/PC817X2NSZ0F?qs=6kT3pPPHxnU7uYWM8Yy85A%3D%3D
K5-K8 = SLA-12VDC-SL-A: Relay or Contactor; Manufacturer_Name: Songle Relay; Datasheet Link: https://datasheet.lcsc.com/szlcsc/1811200235_Ningbo-Songle-Relay-SLA-12VDC-SL-A_C55194.pdf; Height: 20.4mm; Manufacturer_Part_Number: SLA-12VDC-SL-A
LED5-LED8 = 12-21_S2C-FR2S2L_2C: as LED1 on sheet Relay_circuit; Datasheet Link: https://datasheet.lcsc.com/szlcsc/1901141904_Everlight-Elec-12-21-S2C-FR2S2L-2C_C183856.pdf; Height: 2.2mm
P5-P8 = Header 4: Header, 4-Pin; LatestRevisionDate: 17-Jul-2002; LatestRevisionNote: Re-released for DXP Platform.; Publisher: Altium Limited
Q5-Q8 = BC547ATA: as Q1 on sheet Relay_circuit; Datasheet Link: https://www.onsemi.com/pub/Collateral/BC550-D.pdf; Manufacturer_Part_Number: BC547ATA; Mouser Part Number: 512-BC547ATA; Mouser Price/Stock: https://www.mouser.co.uk/ProductDetail/onsemi-Fairchild/BC547ATA?qs=ljbEvF4DwOMRdLfuzO8N4w%3D%3D; Arrow Part Number: BC547ATA; Arrow Price/Stock: https://www.arrow.com/en/products/bc547ata/on-semiconductor?region=europe
R12-R19 = Res3: Resistor; Published: 8-Jun-2000; LatestRevisionDate: 29-May-2009; LatestRevisionNote: IPC-7351 Footprint Added.; PackageReference: J1-0603; Publisher: Altium Limited; PackageDescription: Chip Resistor

## Sheet Wifi, Cellular, MD and FRAM.SchDoc
size A4; SheetNumber: 5; SheetTotal: 7
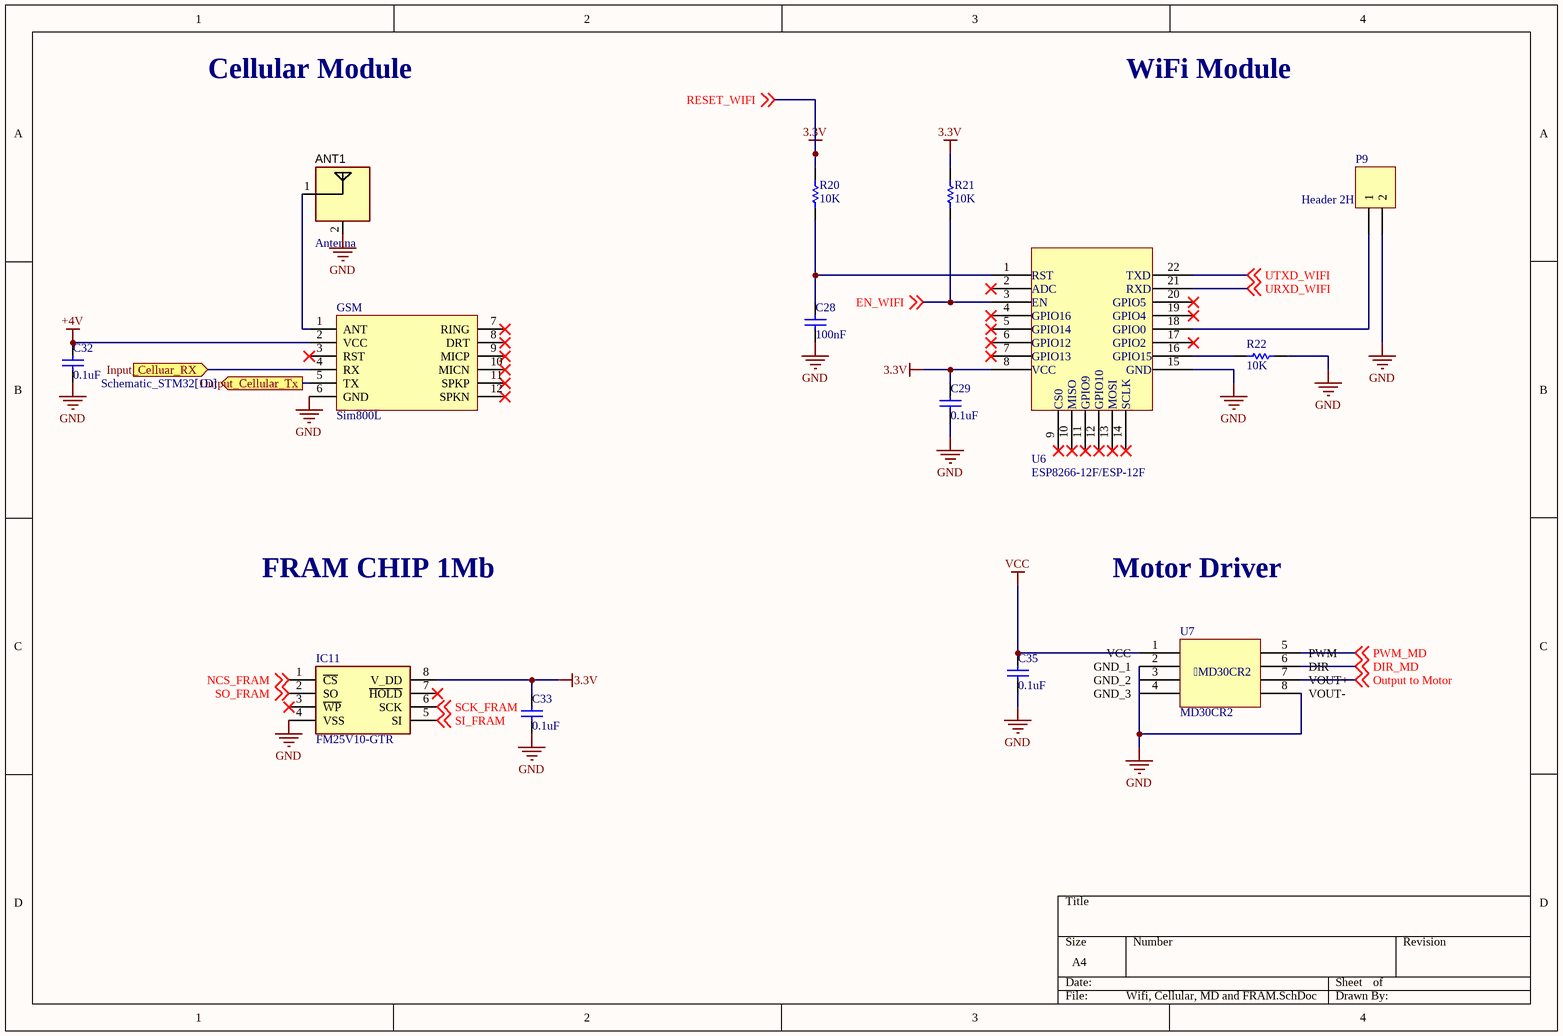
[diagram p4: Wifi, Cellular, MD and FRAM.SchDoc]

### Parts
ANT1  value Antenna  [ANT_IFA_2P4G]  (no BOM)
C28  value 100nF  [RAD-0.3]  (hidden comment: Cap)
C29  value 0.1uF  [RAD-0.3]  (hidden comment: Cap)
C32  value 0.1uF  [RAD-0.3]  (hidden comment: Cap)
C33  value 0.1uF  [RAD-0.3]  (hidden comment: Cap)
C35  value 0.1uF  [RAD-0.3]  (hidden comment: Cap)
GSM  Sim800L  [Sim800L]
IC11  FM25V10-GTR  [SOIC127P602X173-8N]
P9  Header 2H  [HDR1X2H]
R20  value 10K  [AXIAL-0.3]  (hidden comment: Res1)
R21  value 10K  [AXIAL-0.3]  (hidden comment: Res1)
R22  value 10K  [AXIAL-0.3]  (hidden comment: Res1)
U6  ESP8266-12F/ESP-12F
U7  MD30CR2

### Ports
Input_Celluar_RX (in), Output_Cellular_Tx (out, see Schematic_STM32[1D])

### Nets
3.3V: C29.2 C33.2 IC11.8(V_DD) R20.1 R21.1 ; off-sheet RESET_WIFI  [also labelled RESET_WIFI]
+4V: C32.2 GSM.2(VCC)
GND: ANT1.2(GND) C28.1 C29.1 C32.1 C33.1 C35.1 GSM.6(GND) IC11.4(VSS) P9.2 R22.2
VCC: C35.2
EN_WIFI: R21.2 ; off-sheet EN_WIFI
NCS_FRAM: IC11.1(~{CS}) ; off-sheet NCS_FRAM
SCK_FRAM: IC11.6(SCK) ; off-sheet SCK_FRAM
SI_FRAM: IC11.5(SI) ; off-sheet SI_FRAM
SO_FRAM: IC11.2(SO) ; off-sheet SO_FRAM
NetANT1_1: ANT1.1 GSM.1(ANT)
NetC28_2: C28.2 R20.2
NetGSM_4: GSM.4(RX) ; port Input_Celluar_RX
NetGSM_5: GSM.5(TX) ; port Output_Cellular_Tx

Not connected (* = marked no-connect by the designer): GSM 3(RST)* 7(RING)* 8(DRT)* 9(MICP)* 10(MICN)* 11(SPKP)* 12(SPKN)*; IC11 3(~{WP})* 7(~{HOLD})*; P9 1; R22 1; U6 1(RST) 2(ADC) 3(EN) 4(GPIO16) 5(GPIO14) 6(GPIO12) 7(GPIO13) 8(VCC) 9(CS0) 10(MISO) 11(8) 12(8) 13(8) 14(8) 15(GND) 16(GPIO15) 17(GPIO2) 18(GPIO0) 19(GPIO4) 20(GPIO5) 21(RXD) 22(TXD); U7 1(VCC) 2(GND_1) 3(GND_2) 4(GND_3) 5(PWM) 6(DIR) 7(VOUT+) 8(VOUT-)

### Notes on the sheet
- Cellular Module
- WiFi Module
- FRAM CHIP 1Mb
- Motor Driver
- (in symbol ESP-12F) GPIO9; GPIO10; MOSI; SCLK

### Library data of the parts
ANT1 = TESTPOINT_SMD: TEST POINT; MANF: MANF; MANF_P#: MANF_P#
C28 C29 C32 C33 C35 = Cap: Capacitor; Published: 8-Jun-2000; LatestRevisionDate: 17-Jul-2002; LatestRevisionNote: Re-released for DXP Platform.; PackageReference: RAD-0.3; Publisher: Altium Limited; PackageDescription: Radial Cap, Thru-Hole; 2 Leads; 0.3 in Pin Spacing
GSM = Sim800L: GSM SIM800L
IC11 = FM25V10-GTR: Integrated Circuit; Manufacturer_Name: Infineon; Datasheet Link: https://www.cypress.com/file/41691/download; Height: 1.727mm; Manufacturer_Part_Number: FM25V10-GTR; Mouser Part Number: 877-FM25V10-GTR; Mouser Price/Stock: https://www.mouser.co.uk/ProductDetail/Infineon-Technologies/FM25V10-GTR?qs=pA5MXup5wxEkqZoPzJHFgA%3D%3D; Arrow Part Number: FM25V10-GTR; Arrow Price/Stock: https://www.arrow.com/en/products/fm25v10-gtr/cypress-semiconductor
P9 = Header 2H: Header, 2-Pin, Right Angle; LatestRevisionDate: 17-Jul-2002; LatestRevisionNote: Re-released for DXP Platform.; Publisher: Altium Limited
R20-R22 = Res1: Resistor; Published: 8-Jun-2000; LatestRevisionDate: 17-Jul-2002; LatestRevisionNote: Re-released for DXP Platform.; PackageReference: AXIAL-0.3; Publisher: Altium Limited; PackageDescription: Axial Device, Thru-Hole; 2 Leads; 0.3 in Pin Spacing
U6 = ESP-12F: Integrated Circuit; MODEL NO: ESP8266 ESP-12F WiFi Module; Module's dimensions: 24mm x 16mm x 3.4mm (0.95" x 0.63" x 0.13")
U7 = MD30CR2: Motor Driver; Datasheet: https://robu.in/wp-content/uploads/2014/12/MD30C-Users-Manual-Google-Docs.pdf

## Sheet Signal conditioning.SchDoc
size A4; SheetNumber: 7; SheetTotal: 7
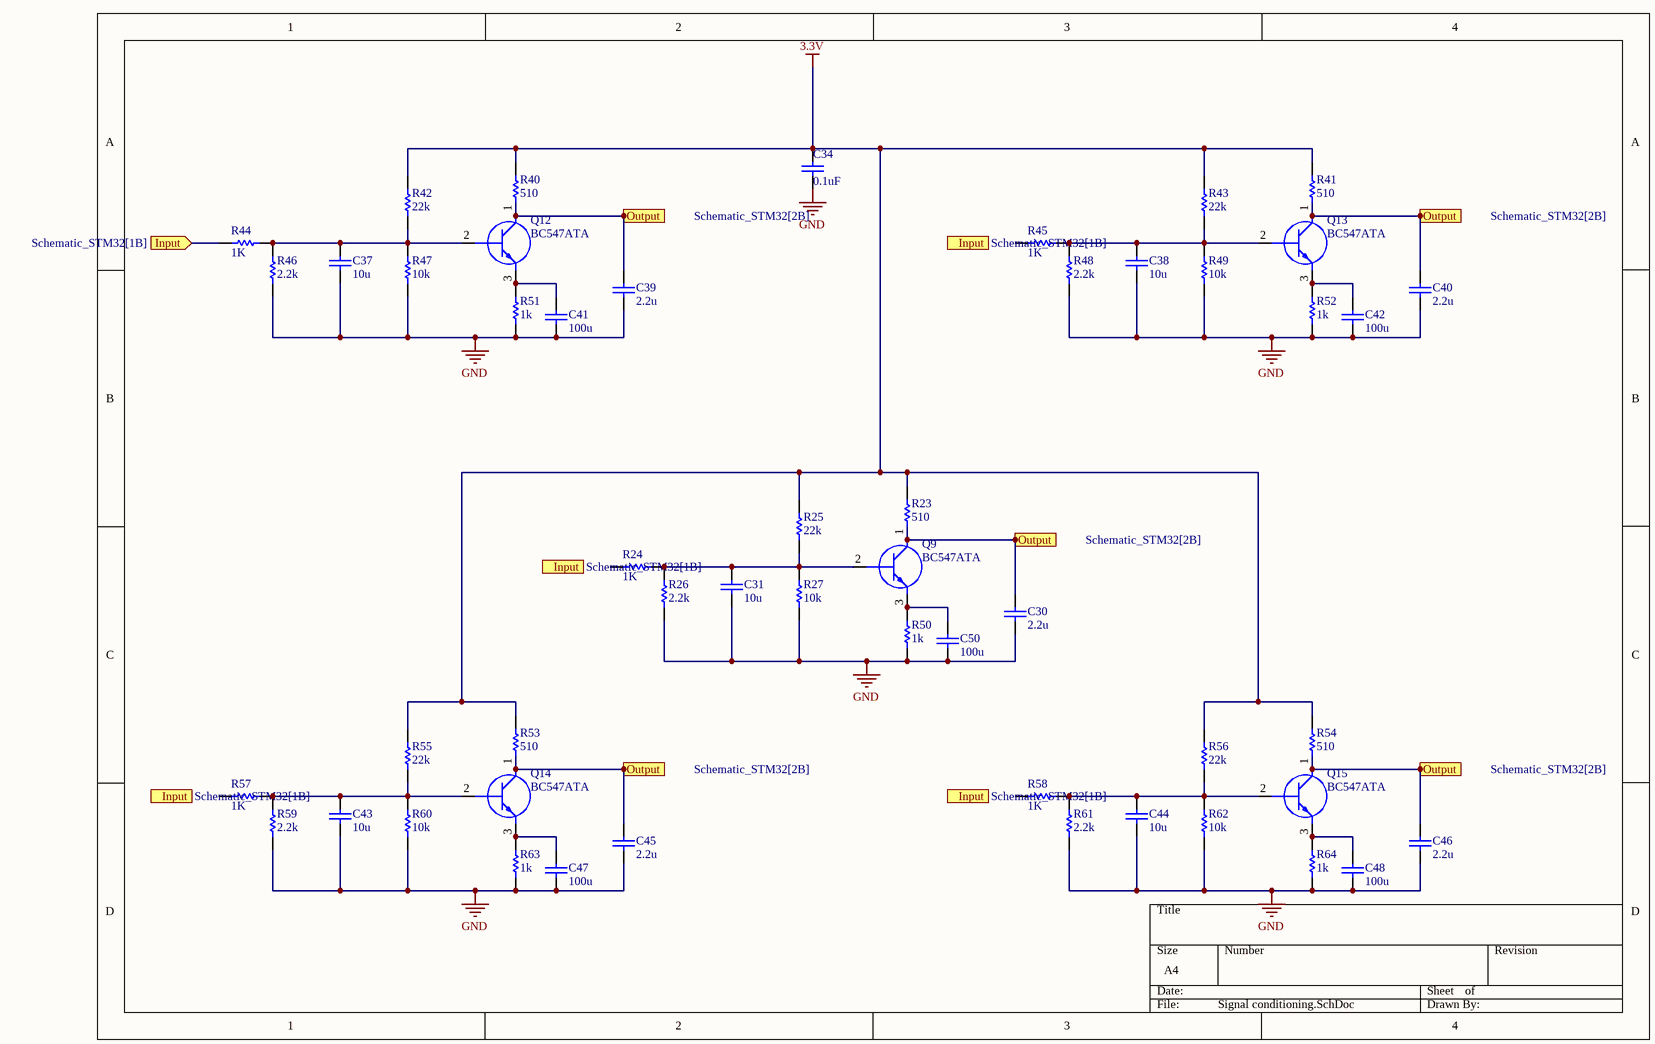
[diagram p5: Signal conditioning.SchDoc]

### Parts
C30  value 2.2u  (hidden comment: Capacitor)
C31  value 10u  (hidden comment: Capacitor)
C34  value 0.1uF  [RAD-0.3]  (hidden comment: Cap)
C37  value 10u  (hidden comment: Capacitor)
C38  value 10u  (hidden comment: Capacitor)
C39  value 2.2u  (hidden comment: Capacitor)
C40  value 2.2u  (hidden comment: Capacitor)
C41  value 100u  (hidden comment: Capacitor)
C42  value 100u  (hidden comment: Capacitor)
C43  value 10u  (hidden comment: Capacitor)
C44  value 10u  (hidden comment: Capacitor)
C45  value 2.2u  (hidden comment: Capacitor)
C46  value 2.2u  (hidden comment: Capacitor)
C47  value 100u  (hidden comment: Capacitor)
C48  value 100u  (hidden comment: Capacitor)
C50  value 100u  (hidden comment: Capacitor)
Q9  BC547ATA  [TO-92_(TO-226)]
Q12  BC547ATA  [TO-92_(TO-226)]
Q13  BC547ATA  [TO-92_(TO-226)]
Q14  BC547ATA  [TO-92_(TO-226)]
Q15  BC547ATA  [TO-92_(TO-226)]
R23  value 510  (hidden comment: Resistor)
R24  value 1K  (hidden comment: Resistor)
R25  value 22k  (hidden comment: Resistor)
R26  value 2.2k  (hidden comment: Resistor)
R27  value 10k  (hidden comment: Resistor)
R40  value 510  (hidden comment: Resistor)
R41  value 510  (hidden comment: Resistor)
R42  value 22k  (hidden comment: Resistor)
R43  value 22k  (hidden comment: Resistor)
R44  value 1K  (hidden comment: Resistor)
R45  value 1K  (hidden comment: Resistor)
R46  value 2.2k  (hidden comment: Resistor)
R47  value 10k  (hidden comment: Resistor)
R48  value 2.2k  (hidden comment: Resistor)
R49  value 10k  (hidden comment: Resistor)
R50  value 1k  (hidden comment: Resistor)
R51  value 1k  (hidden comment: Resistor)
R52  value 1k  (hidden comment: Resistor)
R53  value 510  (hidden comment: Resistor)
R54  value 510  (hidden comment: Resistor)
R55  value 22k  (hidden comment: Resistor)
R56  value 22k  (hidden comment: Resistor)
R57  value 1K  (hidden comment: Resistor)
R58  value 1K  (hidden comment: Resistor)
R59  value 2.2k  (hidden comment: Resistor)
R60  value 10k  (hidden comment: Resistor)
R61  value 2.2k  (hidden comment: Resistor)
R62  value 10k  (hidden comment: Resistor)
R63  value 1k  (hidden comment: Resistor)
R64  value 1k  (hidden comment: Resistor)

### Ports
Input (in, see Schematic_STM32[1B]), Output (out, see Schematic_STM32[2B])

### Nets
3.3V: C34.2 R23.2 R25.2 R40.2 R41.2 R42.2 R43.2 R53.2 R54.2 R55.2 R56.2
GND: C30.2 C31.2 C34.1 C37.2 C38.2 C39.2 C40.2 C41.1 C42.1 C43.2 C44.2 C45.2 C46.2 C47.1 C48.1 C50.1 R26.1 R27.1 R46.1 R47.1 R48.1 R49.1 R50.1 R51.1 R52.1 R59.1 R60.1 R61.1 R62.1 R63.1 R64.1
NetC30_1: C30.1 C39.1 C40.1 C45.1 C46.1 Q9.1(C) Q12.1(C) Q13.1(C) Q14.1(C) Q15.1(C) R23.1 R40.1 R41.1 R53.1 R54.1 ; port Output
NetC31_1: C31.1 Q9.2(B) R24.2 R25.1 R26.2 R27.2
NetC37_1: C37.1 Q12.2(B) R42.1 R44.2 R46.2 R47.2
NetC38_1: C38.1 Q13.2(B) R43.1 R45.2 R48.2 R49.2
NetC41_2: C41.2 Q12.3(E) R51.2
NetC42_2: C42.2 Q13.3(E) R52.2
NetC43_1: C43.1 Q14.2(B) R55.1 R57.2 R59.2 R60.2
NetC44_1: C44.1 Q15.2(B) R56.1 R58.2 R61.2 R62.2
NetC47_2: C47.2 Q14.3(E) R63.2
NetC48_2: C48.2 Q15.3(E) R64.2
NetC50_2: C50.2 Q9.3(E) R50.2
NetR44_1: R44.1 ; port Input

Not connected (* = marked no-connect by the designer): R24 1; R45 1; R57 1; R58 1

### Library data of the parts
C30 C31 C37-C48 C50 = Capacitor: SimulationGenericComponent: True
C34 = Cap: Capacitor; Published: 8-Jun-2000; LatestRevisionDate: 17-Jul-2002; LatestRevisionNote: Re-released for DXP Platform.; PackageReference: RAD-0.3; Publisher: Altium Limited; PackageDescription: Radial Cap, Thru-Hole; 2 Leads; 0.3 in Pin Spacing
Q9 Q12-Q15 = BC547ATA: as Q1 on sheet Relay_circuit; Datasheet Link: https://www.onsemi.com/pub/Collateral/BC550-D.pdf; Manufacturer_Part_Number: BC547ATA; Mouser Part Number: 512-BC547ATA; Mouser Price/Stock: https://www.mouser.co.uk/ProductDetail/onsemi-Fairchild/BC547ATA?qs=ljbEvF4DwOMRdLfuzO8N4w%3D%3D; Arrow Part Number: BC547ATA; Arrow Price/Stock: https://www.arrow.com/en/products/bc547ata/on-semiconductor?region=europe
R23-R27 R40-R64 = Resistor: TC1: 0; SimulationGenericComponent: True; TC2: 0

## Sheet PWM_Generator.SchDoc
size A4; SheetNumber: 7; SheetTotal: 7
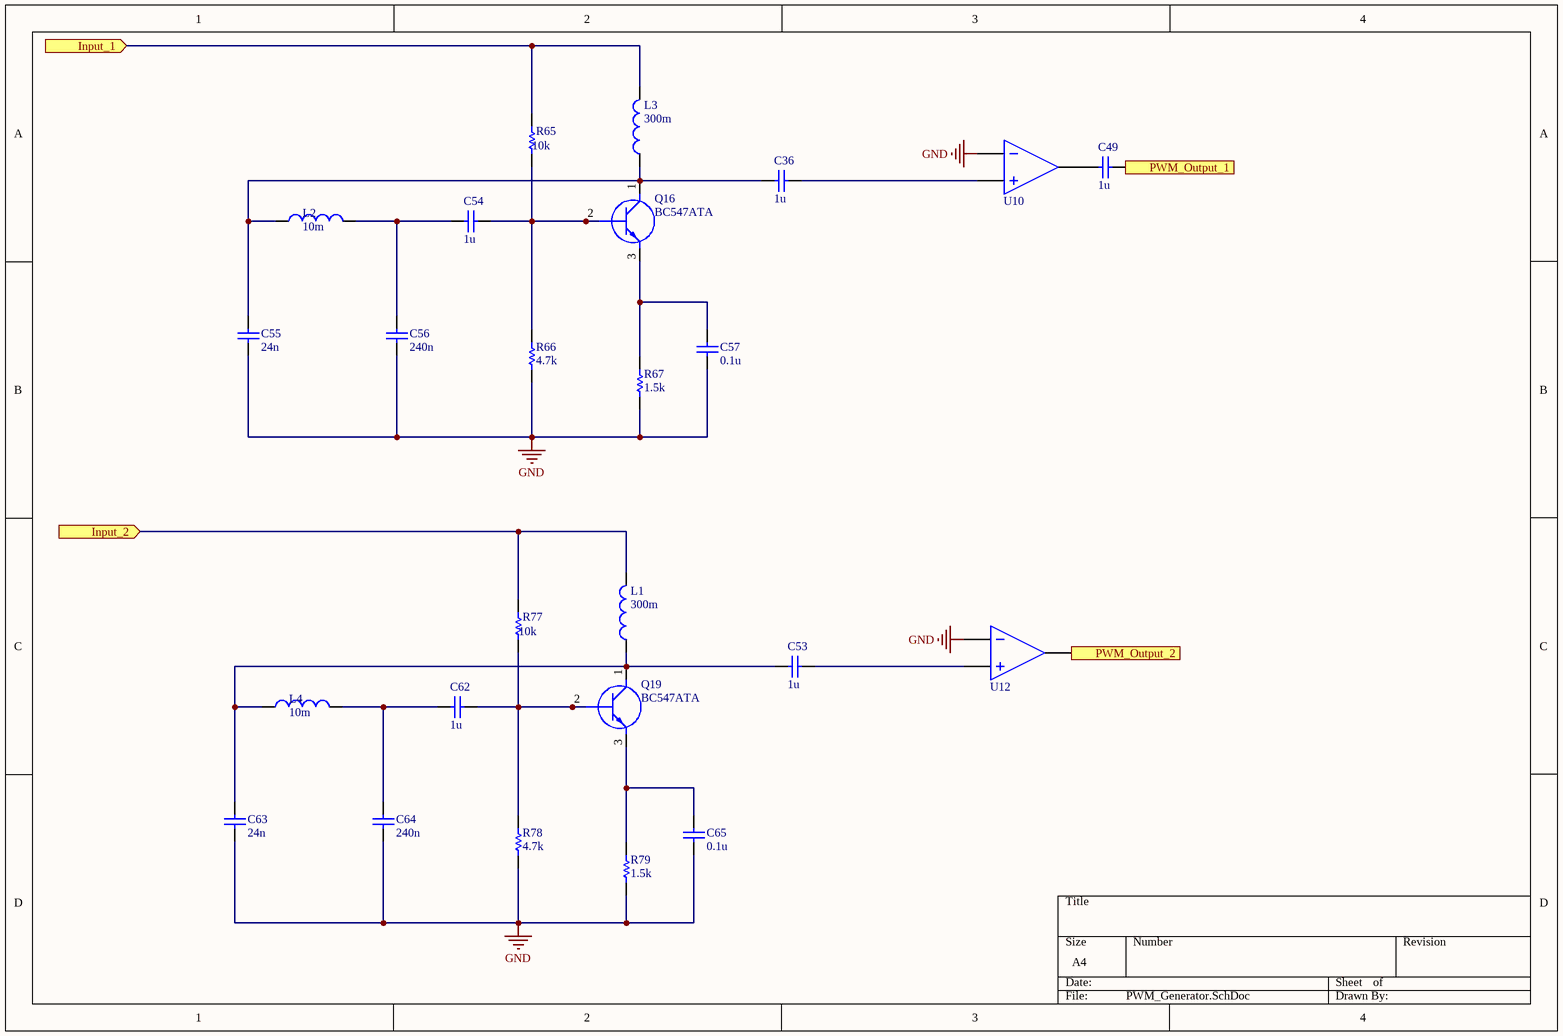
[diagram p6: PWM_Generator.SchDoc]

### Parts
C36  value 1u  (hidden comment: Capacitor)
C49  value 1u  (hidden comment: Capacitor)
C53  value 1u  (hidden comment: Capacitor)
C54  value 1u  (hidden comment: Capacitor)
C55  value 24n  (hidden comment: Capacitor)
C56  value 240n  (hidden comment: Capacitor)
C57  value 0.1u  (hidden comment: Capacitor)
C62  value 1u  (hidden comment: Capacitor)
C63  value 24n  (hidden comment: Capacitor)
C64  value 240n  (hidden comment: Capacitor)
C65  value 0.1u  (hidden comment: Capacitor)
L1  value 300m  (hidden comment: Inductor)
L2  value 10m  (hidden comment: Inductor)
L3  value 300m  (hidden comment: Inductor)
L4  value 10m  (hidden comment: Inductor)
Q16  BC547ATA  [TO-92_(TO-226)]
Q19  BC547ATA  [TO-92_(TO-226)]
R65  value 10k  (hidden comment: Resistor)
R66  value 4.7k  (hidden comment: Resistor)
R67  value 1.5k  (hidden comment: Resistor)
R77  value 10k  (hidden comment: Resistor)
R78  value 4.7k  (hidden comment: Resistor)
R79  value 1.5k  (hidden comment: Resistor)
U10  Ideal Comparator  (value not drawn)
U12  Ideal Comparator  (value not drawn)

### Ports
Input_1 (in), Input_2 (in), PWM_Output_1 (out), PWM_Output_2 (out)

### Nets
GND: C55.1 C56.1 C57.1 C63.1 C64.1 C65.1 R66.1 R67.1 R78.1 R79.1 U10.1(IN-) U12.1(IN-)
NetC36_1: C36.1 C55.2 L2.1 L3.1 Q16.1(C)
NetC36_2: C36.2 U10.2(IN+)
NetC49_1: C49.1 U10.3(OUT)
NetC49_2: C49.2 ; port PWM_Output_1
NetC53_1: C53.1 C63.2 L1.1 L4.1 Q19.1(C)
NetC53_2: C53.2 U12.2(IN+)
NetC54_1: C54.1 C56.2 L2.2
NetC54_2: C54.2 Q16.2(B) R65.1 R66.2
NetC57_2: C57.2 Q16.3(E) R67.2
NetC62_1: C62.1 C64.2 L4.2
NetC62_2: C62.2 Q19.2(B) R77.1 R78.2
NetC65_2: C65.2 Q19.3(E) R79.2
NetL1_2: L1.2 R77.2 ; port Input_2
NetL3_2: L3.2 R65.2 ; port Input_1
NetU12_3: U12.3(OUT) ; port PWM_Output_2

### Library data of the parts
C36 C49 C53-C57 C62-C65 = Capacitor: SimulationGenericComponent: True
L1-L4 = Inductor: SimulationGenericComponent: True
Q16 Q19 = BC547ATA: as Q1 on sheet Relay_circuit; Datasheet Link: https://www.onsemi.com/pub/Collateral/BC550-D.pdf; Manufacturer_Part_Number: BC547ATA; Mouser Part Number: 512-BC547ATA; Mouser Price/Stock: https://www.mouser.co.uk/ProductDetail/onsemi-Fairchild/BC547ATA?qs=ljbEvF4DwOMRdLfuzO8N4w%3D%3D; Arrow Part Number: BC547ATA; Arrow Price/Stock: https://www.arrow.com/en/products/bc547ata/on-semiconductor?region=europe
R65-R67 R77-R79 = Resistor: TC1: 0; SimulationGenericComponent: True; TC2: 0
U10 = Comparator: VHIGH: 3.3; VLOW: 0; VHYS: 50m; SimulationGenericComponent: True
U12 = Comparator: VHIGH: 5; VLOW: 100m; VHYS: 50m; SimulationGenericComponent: True

## Nets that join several sheets
1.8V: Schematic_STM32 (C15.1 IC1.121), supply (C26.2 U5.2)
3.3V: Schematic_STM32 (32 pins), supply (7 pins), Wifi, Cellular, MD and FRAM (5 pins), Signal conditioning (11 pins)
5V: Relay_circuit (R4.1 R5.1 R8.1 R9.1), Relay circuit_12V (R12.1 R14.1 R16.1 R17.1)
GND: Schematic_STM32 (45 pins), supply (14 pins), Relay_circuit (Q1.3 Q2.3 Q3.3 Q4.3), Relay circuit_12V (Q5.3 Q6.3 Q7.3 Q8.3), Wifi, Cellular, MD and FRAM (10 pins), Signal conditioning (31 pins), PWM_Generator (12 pins)
VCC: Relay_circuit (12 pins), Relay circuit_12V (12 pins), Wifi, Cellular, MD and FRAM (C35.2)
IN1: Schematic_STM32 (IC1.56), Relay_circuit (LED2.1)
IN2: Schematic_STM32 (IC1.57), Relay_circuit (LED1.1)
IN3: Schematic_STM32 (IC1.87), Relay_circuit (LED4.1)
IN4: Schematic_STM32 (IC1.88), Relay_circuit (LED3.1)
IN5: Schematic_STM32 (IC1.89), Relay circuit_12V (LED5.1)
IN6: Schematic_STM32 (IC1.90), Relay circuit_12V (LED6.1)
IN7: Schematic_STM32 (IC1.91), Relay circuit_12V (LED7.1)
IN8: Schematic_STM32 (IC1.92), Relay circuit_12V (LED8.1)
NCS_FRAM: Schematic_STM32 (IC1.65), Wifi, Cellular, MD and FRAM (IC11.1)
RTC_IRQ: Schematic_STM32 (IC1.96), supply (R1.2 U4.7)
RTC_SCL: Schematic_STM32 (IC1.11), supply (R2.2 U4.6)
RTC_SDA: Schematic_STM32 (IC1.10), supply (R3.2 U4.5)
SCK_FRAM: Schematic_STM32 (IC1.104), Wifi, Cellular, MD and FRAM (IC11.6)
SI_FRAM: Schematic_STM32 (IC1.67), Wifi, Cellular, MD and FRAM (IC11.5)
SO_FRAM: Schematic_STM32 (IC1.66), Wifi, Cellular, MD and FRAM (IC11.2)